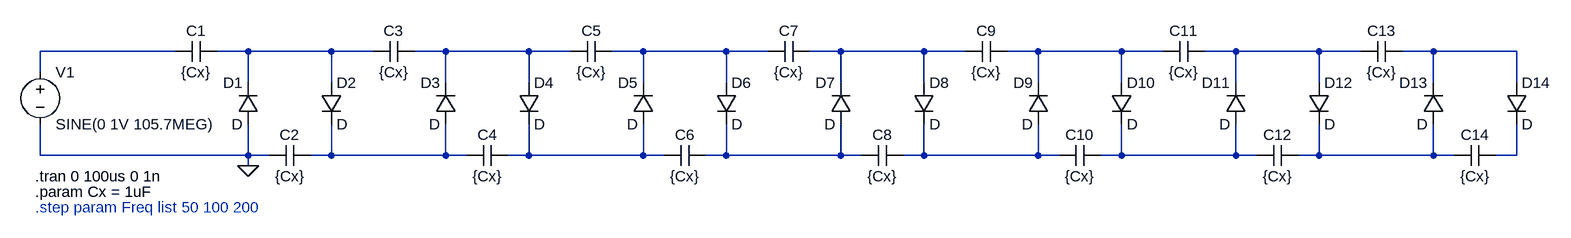
[diagram p0: schematic Standard_voltage_multiplier.asc]
Standard_voltage_multiplier.asc, the LTspice schematic file:
Version 4
SHEET 1 2716 680
WIRE 32 112 -176 112
WIRE 144 112 96 112
WIRE 272 112 144 112
WIRE 336 112 272 112
WIRE 448 112 400 112
WIRE 576 112 448 112
WIRE 640 112 576 112
WIRE 752 112 704 112
WIRE 880 112 752 112
WIRE 944 112 880 112
WIRE 1056 112 1008 112
WIRE 1184 112 1056 112
WIRE 1248 112 1184 112
WIRE 1360 112 1312 112
WIRE 1488 112 1360 112
WIRE 1552 112 1488 112
WIRE 1664 112 1616 112
WIRE 1792 112 1664 112
WIRE 1856 112 1792 112
WIRE 1968 112 1920 112
WIRE 2096 112 1968 112
WIRE -176 144 -176 112
WIRE 144 160 144 112
WIRE 272 160 272 112
WIRE 448 160 448 112
WIRE 576 160 576 112
WIRE 752 160 752 112
WIRE 880 160 880 112
WIRE 1056 160 1056 112
WIRE 1184 160 1184 112
WIRE 1360 160 1360 112
WIRE 1488 160 1488 112
WIRE 1664 160 1664 112
WIRE 1792 160 1792 112
WIRE 1968 160 1968 112
WIRE 2096 160 2096 112
WIRE -176 272 -176 224
WIRE 144 272 144 224
WIRE 144 272 -176 272
WIRE 176 272 144 272
WIRE 272 272 272 224
WIRE 272 272 240 272
WIRE 448 272 448 224
WIRE 448 272 272 272
WIRE 480 272 448 272
WIRE 576 272 576 224
WIRE 576 272 544 272
WIRE 752 272 752 224
WIRE 752 272 576 272
WIRE 784 272 752 272
WIRE 880 272 880 224
WIRE 880 272 848 272
WIRE 1056 272 1056 224
WIRE 1056 272 880 272
WIRE 1088 272 1056 272
WIRE 1184 272 1184 224
WIRE 1184 272 1152 272
WIRE 1360 272 1360 224
WIRE 1360 272 1184 272
WIRE 1392 272 1360 272
WIRE 1488 272 1488 224
WIRE 1488 272 1456 272
WIRE 1664 272 1664 224
WIRE 1664 272 1488 272
WIRE 1696 272 1664 272
WIRE 1792 272 1792 224
WIRE 1792 272 1760 272
WIRE 1968 272 1968 224
WIRE 1968 272 1792 272
WIRE 2000 272 1968 272
WIRE 2096 272 2096 224
WIRE 2096 272 2064 272
WIRE 144 288 144 272
FLAG 144 288 0
SYMBOL cap 32 128 R270
WINDOW 0 32 32 VTop 2
WINDOW 3 0 32 VBottom 2
SYMATTR InstName C1
SYMATTR Value {Cx}
SYMBOL voltage -176 128 R0
WINDOW 123 0 0 Left 2
WINDOW 39 0 0 Left 2
SYMATTR InstName V1
SYMATTR Value SINE(0 1V 105.7MEG)
SYMBOL diode 160 224 R180
WINDOW 0 24 64 Left 2
WINDOW 3 24 0 Left 2
SYMATTR InstName D1
SYMBOL cap 176 288 R270
WINDOW 0 32 32 VTop 2
WINDOW 3 0 32 VBottom 2
SYMATTR InstName C2
SYMATTR Value {Cx}
SYMBOL diode 256 160 R0
SYMATTR InstName D2
SYMBOL cap 336 128 R270
WINDOW 0 32 32 VTop 2
WINDOW 3 0 32 VBottom 2
SYMATTR InstName C3
SYMATTR Value {Cx}
SYMBOL diode 464 224 R180
WINDOW 0 24 64 Left 2
WINDOW 3 24 0 Left 2
SYMATTR InstName D3
SYMBOL diode 560 160 R0
SYMATTR InstName D4
SYMBOL cap 480 288 R270
WINDOW 0 32 32 VTop 2
WINDOW 3 0 32 VBottom 2
SYMATTR InstName C4
SYMATTR Value {Cx}
SYMBOL cap 640 128 R270
WINDOW 0 32 32 VTop 2
WINDOW 3 0 32 VBottom 2
SYMATTR InstName C5
SYMATTR Value {Cx}
SYMBOL diode 768 224 R180
WINDOW 0 24 64 Left 2
WINDOW 3 24 0 Left 2
SYMATTR InstName D5
SYMBOL diode 864 160 R0
SYMATTR InstName D6
SYMBOL cap 784 288 R270
WINDOW 0 32 32 VTop 2
WINDOW 3 0 32 VBottom 2
SYMATTR InstName C6
SYMATTR Value {Cx}
SYMBOL cap 944 128 R270
WINDOW 0 32 32 VTop 2
WINDOW 3 0 32 VBottom 2
SYMATTR InstName C7
SYMATTR Value {Cx}
SYMBOL diode 1072 224 R180
WINDOW 0 24 64 Left 2
WINDOW 3 24 0 Left 2
SYMATTR InstName D7
SYMBOL diode 1168 160 R0
SYMATTR InstName D8
SYMBOL cap 1088 288 R270
WINDOW 0 32 32 VTop 2
WINDOW 3 0 32 VBottom 2
SYMATTR InstName C8
SYMATTR Value {Cx}
SYMBOL cap 1248 128 R270
WINDOW 0 32 32 VTop 2
WINDOW 3 0 32 VBottom 2
SYMATTR InstName C9
SYMATTR Value {Cx}
SYMBOL diode 1376 224 R180
WINDOW 0 24 64 Left 2
WINDOW 3 24 0 Left 2
SYMATTR InstName D9
SYMBOL diode 1472 160 R0
SYMATTR InstName D10
SYMBOL cap 1392 288 R270
WINDOW 0 32 32 VTop 2
WINDOW 3 0 32 VBottom 2
SYMATTR InstName C10
SYMATTR Value {Cx}
SYMBOL cap 1552 128 R270
WINDOW 0 32 32 VTop 2
WINDOW 3 0 32 VBottom 2
SYMATTR InstName C11
SYMATTR Value {Cx}
SYMBOL diode 1680 224 R180
WINDOW 0 24 64 Left 2
WINDOW 3 24 0 Left 2
SYMATTR InstName D11
SYMBOL diode 1776 160 R0
SYMATTR InstName D12
SYMBOL cap 1696 288 R270
WINDOW 0 32 32 VTop 2
WINDOW 3 0 32 VBottom 2
SYMATTR InstName C12
SYMATTR Value {Cx}
SYMBOL cap 1856 128 R270
WINDOW 0 32 32 VTop 2
WINDOW 3 0 32 VBottom 2
SYMATTR InstName C13
SYMATTR Value {Cx}
SYMBOL diode 1984 224 R180
WINDOW 0 24 64 Left 2
WINDOW 3 24 0 Left 2
SYMATTR InstName D13
SYMBOL diode 2080 160 R0
SYMATTR InstName D14
SYMBOL cap 2000 288 R270
WINDOW 0 32 32 VTop 2
WINDOW 3 0 32 VBottom 2
SYMATTR InstName C14
SYMATTR Value {Cx}
TEXT -184 304 Left 2 !.tran 0 100us 0 1n
TEXT -184 328 Left 2 !.param Cx = 1uF
TEXT -184 352 Left 2 ;.step param Freq list 50 100 200

The netlist it stands for:
* Standard_voltage_multiplier.asc
C1 N001 N002 {Cx}
V1 N001 0 SINE(0 1V 105.7MEG)
D1 0 N002 D
C2 0 N009 {Cx}
D2 N002 N009 D
C3 N002 N003 {Cx}
D3 N009 N003 D
D4 N003 N010 D
C4 N009 N010 {Cx}
C5 N003 N004 {Cx}
D5 N010 N004 D
D6 N004 N011 D
C6 N010 N011 {Cx}
C7 N004 N005 {Cx}
D7 N011 N005 D
D8 N005 N012 D
C8 N011 N012 {Cx}
C9 N005 N006 {Cx}
D9 N012 N006 D
D10 N006 N013 D
C10 N012 N013 {Cx}
C11 N006 N007 {Cx}
D11 N013 N007 D
D12 N007 N014 D
C12 N013 N014 {Cx}
C13 N007 N008 {Cx}
D13 N014 N008 D
D14 N008 N015 D
C14 N014 N015 {Cx}
.model D D
.lib standard.dio
.tran 0 100us 0 1n
.param Cx = 1uF
* .step param Freq list 50 100 200
.backanno
.end